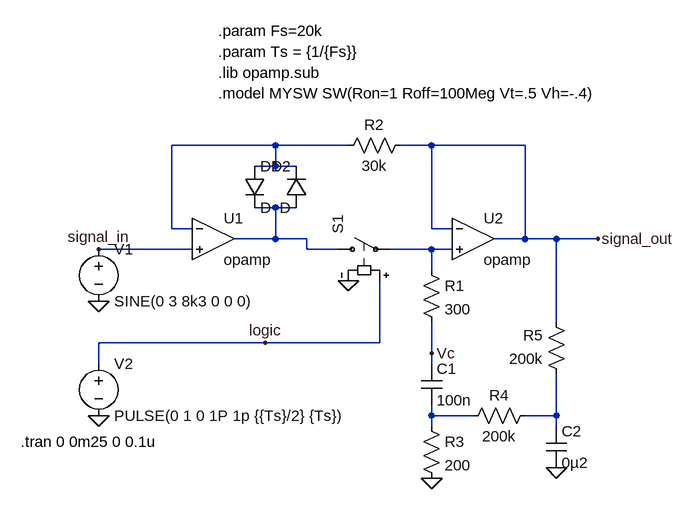
[diagram p0: schematic syh.asc]
syh.asc, the LTspice schematic file:
Version 4
SHEET 1 880 680
WIRE 160 32 0 32
WIRE 272 32 160 32
WIRE 400 32 352 32
WIRE 544 32 400 32
WIRE 160 64 160 32
WIRE 160 64 128 64
WIRE 192 64 160 64
WIRE 160 128 128 128
WIRE 192 128 160 128
WIRE 0 160 0 32
WIRE 32 160 0 160
WIRE 400 160 400 32
WIRE 432 160 400 160
WIRE 160 176 160 128
WIRE 160 176 96 176
WIRE 208 176 160 176
WIRE 544 176 544 32
WIRE 544 176 496 176
WIRE 592 176 544 176
WIRE 656 176 592 176
WIRE 32 192 -112 192
WIRE 208 192 208 176
WIRE 256 192 208 192
WIRE 400 192 336 192
WIRE 432 192 400 192
WIRE 400 224 400 192
WIRE 592 304 592 176
WIRE 144 336 -112 336
WIRE 320 336 320 240
WIRE 320 336 144 336
WIRE 400 352 400 304
WIRE -112 368 -112 336
WIRE 400 368 400 352
WIRE 400 448 400 432
WIRE 464 448 400 448
WIRE 592 448 592 384
WIRE 592 448 544 448
WIRE 400 464 400 448
WIRE 592 464 592 448
FLAG 656 176 signal_out
FLAG -112 272 0
FLAG -112 448 0
FLAG 272 240 0
FLAG 144 336 logic
FLAG -112 192 signal_in
FLAG 400 352 Vc
FLAG 400 544 0
FLAG 592 528 0
SYMBOL Opamps\\opamp 64 112 R0
SYMATTR InstName U1
SYMATTR SpiceLine2 GBW=3Meg
SYMBOL Opamps\\opamp 464 112 R0
SYMATTR InstName U2
SYMATTR SpiceLine2 GBW=3Meg
SYMBOL res 384 208 R0
SYMATTR InstName R1
SYMATTR Value 300
SYMATTR SpiceLine tol=6
SYMBOL cap 384 368 R0
SYMATTR InstName C1
SYMATTR Value 100n
SYMBOL res 368 16 R90
WINDOW 0 0 56 VBottom 2
WINDOW 3 32 56 VTop 2
SYMATTR InstName R2
SYMATTR Value 30k
SYMBOL diode 112 64 R0
SYMATTR InstName D1
SYMBOL diode 208 128 R180
WINDOW 0 24 64 Left 2
WINDOW 3 24 0 Left 2
SYMATTR InstName D2
SYMBOL voltage -112 176 R0
WINDOW 123 0 0 Left 0
WINDOW 39 0 0 Left 0
SYMATTR InstName V1
SYMATTR Value SINE(0 3 8k3 0 0 0)
SYMBOL voltage -112 352 R0
WINDOW 123 0 0 Left 0
WINDOW 39 0 0 Left 0
SYMATTR InstName V2
SYMATTR Value PULSE(0 1 0 1P 1p {{Ts}/2} {Ts})
SYMBOL sw 240 192 R270
SYMATTR InstName S1
SYMATTR Value ""
SYMATTR SpiceModel MYSW
SYMBOL res 384 448 R0
SYMATTR InstName R3
SYMATTR Value 200
SYMBOL res 560 432 R90
WINDOW 0 0 56 VBottom 2
WINDOW 3 32 56 VTop 2
SYMATTR InstName R4
SYMATTR Value 200k
SYMBOL res 608 400 R180
WINDOW 0 36 76 Left 2
WINDOW 3 36 40 Left 2
SYMATTR InstName R5
SYMATTR Value 200k
SYMBOL cap 576 464 R0
SYMATTR InstName C2
SYMATTR Value 0µ2
TEXT 72 -144 Left 2 !.param Fs=20k
TEXT 72 -112 Left 2 !.param Ts = {1/{Fs}}
TEXT 72 -80 Left 2 !.lib opamp.sub
TEXT 72 -48 Left 2 !.model MYSW SW(Ron=1 Roff=100Meg Vt=.5 Vh=-.4)
TEXT -232 488 Left 2 !.tran 0 0m25 0 0.1u

The netlist it stands for:
* syh.asc
XU1 N001 signal_in N002 opamp Aol=100K GBW=3Meg  ; pins invin noninvin out
XU2 signal_out N003 signal_out opamp Aol=100K GBW=3Meg  ; pins invin noninvin out
R1 N003 Vc 300 tol=6
C1 Vc N004 100n
R2 signal_out N001 30k
D1 N001 N002 D
D2 N002 N001 D
V1 signal_in 0 SINE(0 3 8k3 0 0 0)
V2 logic 0 PULSE(0 1 0 1P 1p {{Ts}/2} {Ts})
S1 N002 N003 logic 0 MYSW
R3 N004 0 200
R4 N005 N004 200k
R5 N005 signal_out 200k
C2 N005 0 0µ2
.model D D
.lib standard.dio
.param Fs=20k
.param Ts = {1/{Fs}}
.lib opamp.sub
.model MYSW SW(Ron=1 Roff=100Meg Vt=.5 Vh=-.4)
.tran 0 0m25 0 0.1u
.backanno
.end